# Altium project RWSv3.PrjPcb
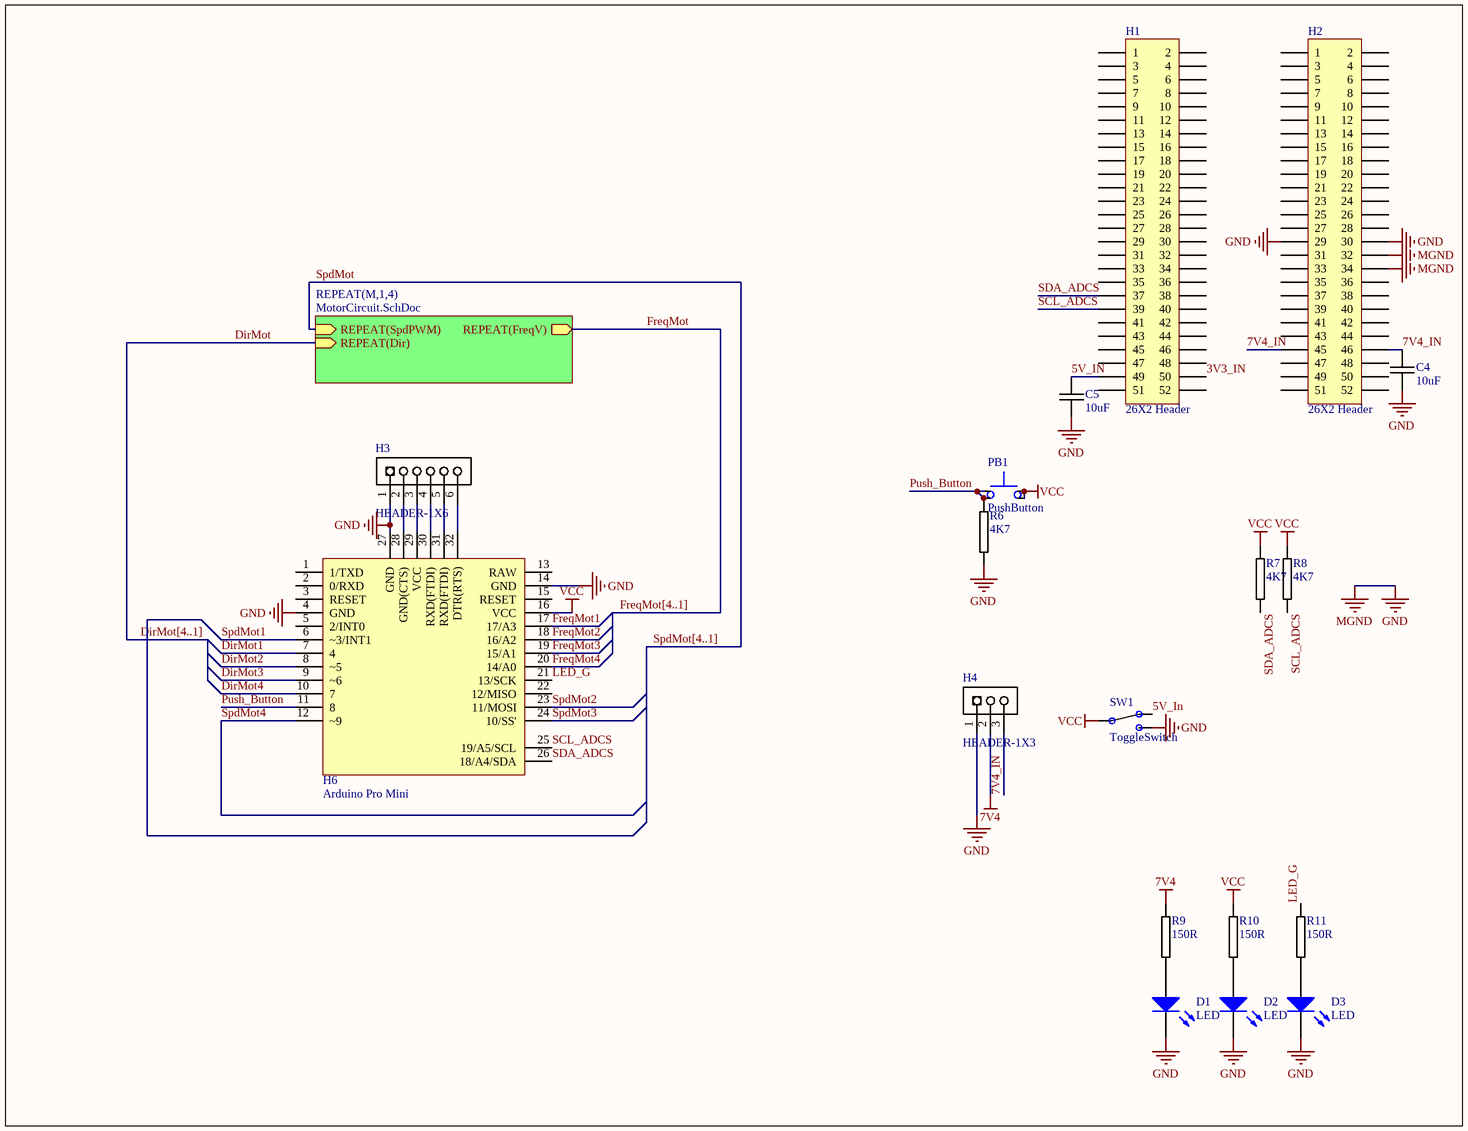
[diagram p0: RWSv3.SchDoc]
2 sheets, 70 parts. Net scope: hierarchical (ports join the sheet entries above them; power ports are global).
Board file: RWSv3.PcbDoc
Sheets:
  RWSv3.SchDoc
    M1 = MotorCircuit.SchDoc
    M2 = MotorCircuit.SchDoc
    M3 = MotorCircuit.SchDoc
    M4 = MotorCircuit.SchDoc

## Sheet RWSv3.SchDoc
size 274 x 210 mm

### Parts
C4  10uF  [0805C-TBD]
C5  10uF  [0805C-TBD]
D1  LED  [LED]
D2  LED  [LED]
D3  LED  [LED]
H1  26X2 Header  [26X2 Header]
H2  26X2 Header  [26X2 Header]
H3  HEADER-1X6  [HEADER-1X6]
H4  HEADER-1X3  [HEADER-1X3]
H6  Arduino Pro Mini  [Arduino Pro Mini]
PB1  PushButton  [PushButton]
R6  4K7  [0805R-4K7]
R7  4K7  [0805R-4K7]
R8  4K7  [0805R-4K7]
R9  150R  [0805R-150]
R10  150R  [0805R-150]
R11  150R  [0805R-150]
SW1  ToggleSwitch  [SWITCHFOOTPRINT]

### Sub-sheets
REPEAT(M,1,4) = MotorCircuit.SchDoc: REPEAT(SpdPWM) (in), REPEAT(Dir) (in), REPEAT(FreqV) (out)

### Nets
7V4: H4.2 R9.1
GND: C4.2 C5.2 D1.2(K) D2.2(K) D3.2(K) H2.29 H2.30 H2.32 H2.34 H3.1 H4.1 H6.4(GND) H6.14(GND) H6.27(GND) R6.2 SW1.25  [also labelled MGND]
VCC: H6.16(VCC) PB1.27 PB1.29 R7.1 R8.1 R10.1 SW1.23
3V3_IN: H1.50
5V_IN: C5.1 H1.49 SW1.24
7V4_IN: C4.1 H2.45 H2.46 H4.3
DirMot: sheet REPEAT(M,1,4)/REPEAT(Dir)
DirMot1: H6.7(4)
DirMot2: H6.8(~5)
DirMot3: H6.9(~6)
DirMot4: H6.10(7)
FreqMot: sheet REPEAT(M,1,4)/REPEAT(FreqV)
FreqMot1: H6.17(17/A3)
FreqMot2: H6.18(16/A2)
FreqMot3: H6.19(15/A1)
FreqMot4: H6.20(14/A0)
LED_G: H6.21(13/SCK) R11.1
Push_Button: H6.11(8) PB1.26 PB1.28 R6.1
SCL_ADCS: H1.39 H6.25(19/A5/SCL) R8.2
SDA_ADCS: H1.37 H6.26(18/A4/SDA) R7.2
SpdMot: sheet REPEAT(M,1,4)/REPEAT(SpdPWM)
SpdMot1: H6.6(~3/INT1)
SpdMot2: H6.23(11/MOSI)
SpdMot3: H6.24(10/SS')
SpdMot4: H6.12(~9)
NetD1_1: D1.1(A) R9.2
NetD2_1: D2.1(A) R10.2
NetD3_1: D3.1(A) R11.2
NetH3_2: H3.2 H6.28(GND(CTS))
NetH3_3: H3.3 H6.29(VCC)
NetH3_4: H3.4 H6.30(RXD(FTDI))
NetH3_5: H3.5 H6.31(RXD(FTDI))
NetH3_6: H3.6 H6.32(DTR(RTS))

Not connected (* = marked no-connect by the designer): H1 1 2 3 4 5 6 7 8 9 10 11 12 13 14 15 16 17 18 19 20 21 22 23 24 25 26 27 28 29 30 31 32 33 34 35 36 38 40 41 42 43 44 45 46 47 48 51 52; H2 1 2 3 4 5 6 7 8 9 10 11 12 13 14 15 16 17 18 19 20 21 22 23 24 25 26 27 28 31 33 35 36 37 38 39 40 41 42 43 44 47 48 49 50 51 52; H6 1(1/TXD) 2(0/RXD) 3(RESET) 5(2/INT0) 13(RAW) 15(RESET) 22(12/MISO)

### Buses and harness runs
bus DirMot[4..1]
bus FreqMot[4..1]
bus SpdMot[4..1]

### Library data of the parts
C4 C5 = 0805C-100nF-25V-X7R-MUR: CAPACITOR 0805 CERAMIC; Supplier 1: Digi-Key; Supplier Part Number 1: 490-1673-1-ND
D1-D3 = LED: Small LED
PB1 = PushButton: pin to pad: 26>5 27>7 28>6 29>8
R6-R8 = 0805R-4K7: RESISTOR 0805 1/4 WATT THIN FILM; Reel: *
R9-R11 = 0805R-150: RESISTOR 0805 1/4 WATT THIN FILM; Reel: *
SW1 = ToggleSwitch: pin to pad: 23>3 24>2 25>4
H3 = HEADER-1X6: Supplier 1: Digi-Key; Supplier Part Number 1: S1011E-36-ND
H4 = HEADER-1X3: Supplier 1: Digi-Key; Supplier Part Number 1: S1011E-36-ND

## Sheet MotorCircuit.SchDoc
size A4
Used 4 times, as channels M1, M2, M3, M4. Parts and nets are listed once, with the designators drawn on the sheet.
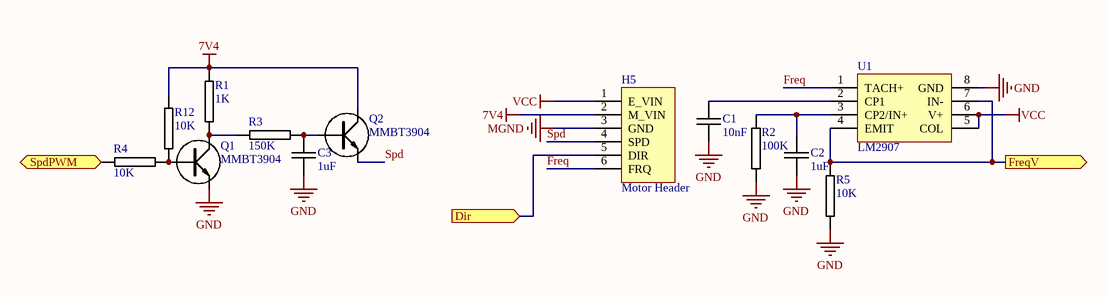
[diagram p1: MotorCircuit.SchDoc]

### Parts
C1  10nF  [0805C-TBD]
C2  1uF  [0805C-GENERIC]
C3  1uF  [0805C-GENERIC]
H5  Motor Header  [Motor Header]
Q1  MMBT3904  [SOT23-BCE]
Q2  MMBT3904  [SOT23-BCE]
R1  1K  [0805R-1K]
R2  100K  [0805R-100K]
R3  150K  [0805R-150K]
R4  10K  [0805R-10K]
R5  10K  [0805R-10K]
R12  10K  [0805R-10K]
U1  LM2907  [LM2907]

### Ports
Dir (in), FreqV (out), SpdPWM (in)

### Nets
7V4: H5.2(M_VIN) Q2.C R1.1 R12.2
GND: C1.2 C2.2 C3.2 Q1.E R2.2 R5.2 U1.8(GND)
MGND: H5.3(GND)
VCC: H5.1(E_VIN) U1.5(COL) U1.6(V+)
Dir: H5.5(DIR) ; port Dir
Freq: H5.6(FRQ) U1.1(TACH+)
FreqV: R5.1 U1.4(EMIT) U1.7(IN-) ; port FreqV
Spd: H5.4(SPD) Q2.E
SpdPWM: R4.1 ; port SpdPWM
NetC1_1: C1.1 U1.2(CP1)
NetC2_1: C2.1 R2.1 U1.3(CP2/IN+)
NetC3_1: C3.1 Q2.B R3.2
NetQ1_B: Q1.B R4.2 R12.1
NetQ1_C: Q1.C R1.2 R3.1

### Channels
M1: designators C1=M1C1 C2=M1C2 C3=M1C3 H5=M1H5 Q1=M1Q1 Q2=M1Q2 R1=M1R1 R2=M1R2 R3=M1R3 R4=M1R4 R5=M1R5 R12=M1R12 U1=M1U1; ports Dir=DirMot1 FreqV=FreqMot1 SpdPWM=SpdMot1
M2: designators C1=M2C1 C2=M2C2 C3=M2C3 H5=M2H5 Q1=M2Q1 Q2=M2Q2 R1=M2R1 R2=M2R2 R3=M2R3 R4=M2R4 R5=M2R5 R12=M2R12 U1=M2U1; ports Dir=DirMot2 FreqV=FreqMot2 SpdPWM=SpdMot2
M3: designators C1=M3C1 C2=M3C2 C3=M3C3 H5=M3H5 Q1=M3Q1 Q2=M3Q2 R1=M3R1 R2=M3R2 R3=M3R3 R4=M3R4 R5=M3R5 R12=M3R12 U1=M3U1; ports Dir=DirMot3 FreqV=FreqMot3 SpdPWM=SpdMot3
M4: designators C1=M4C1 C2=M4C2 C3=M4C3 H5=M4H5 Q1=M4Q1 Q2=M4Q2 R1=M4R1 R2=M4R2 R3=M4R3 R4=M4R4 R5=M4R5 R12=M4R12 U1=M4U1; ports Dir=DirMot4 FreqV=FreqMot4 SpdPWM=SpdMot4

### Library data of the parts
C1 = 0805C-100nF-25V-X7R-MUR: CAPACITOR 0805 CERAMIC; Supplier 1: Digi-Key; Supplier Part Number 1: 490-1673-1-ND
C2 = 0805C-10UF-6V3-X5R-PAN: CAPACITOR 0805 CERAMIC; Manufacturer: Panasonic - ECG; Manufacturer Part Number: ECJ-2FB0J106M; Reel: C1; Capacitance: 10µF; Voltage - Rated: 6.3V; Temperature Coefficient: X5R; Tolerance: ±20%; Supplier 1: Digi-Key; Supplier Part Number 1: PCC2225TR-ND; Supplier: Digi-Key; Operating Temperature: -55°C ~ 85°C; Mounting Type: Surface Mount, MLCC; Lead Spacing: -; RoHS: RoHS Compliant; Packaging: Tape & Reel (TR); Thickness: 1.25mm; Package / Case: 0805 (2012 metric); Features: General Purpose; Category: Capacitors; Supplier Part Number: PCC2225TR-ND
C3 = 0805C-2U2-6V3-X5R-PAN: CAPACITOR 0805 CERAMIC; Manufacturer Part Number: ECJ-1VB0J225K; Manufacturer: Panasonic - ECG; Reel: C7; Supplier 1: Digi-Key; Supplier Part Number 1: PCC2273TR-ND
Q1 Q2 = MMBT2222: BC847 SMALL SIGNAL NPN TRANSISTOR; Supplier 1: Digi-Key; Supplier Part Number 1: MMBT2222A-FDICT-ND
R1 = 0805R-1K: RESISTOR 0805 1/4 WATT THIN FILM; Reel: *
R2 = 0805R-100K: RESISTOR 0805 1/4 WATT THIN FILM; Reel: *; Supplier 1: Digi-Key; Supplier Part Number 1: RMCF0805FT100KTR-ND
R3 = 0805R-150K: RESISTOR 0805 1/4 WATT THIN FILM; Reel: *
R4 R5 R12 = 0805R-10K: RESISTOR 0805 1/4 WATT THIN FILM; Reel: *
U1 = LM2907: Freq to Voltage Converter

## Nets that join several sheets
7V4: RWSv3 (H4.2 R9.1), M1 (M1H5.2 M1Q2.C M1R1.1 M1R12.2), M2 (M2H5.2 M2Q2.C M2R1.1 M2R12.2), M3 (M3H5.2 M3Q2.C M3R1.1 M3R12.2), M4 (M4H5.2 M4Q2.C M4R1.1 M4R12.2)
GND: RWSv3 (16 pins), M1 (8 pins), M2 (8 pins), M3 (8 pins), M4 (8 pins)
VCC: RWSv3 (7 pins), M1 (M1H5.1 M1U1.5 M1U1.6), M2 (M2H5.1 M2U1.5 M2U1.6), M3 (M3H5.1 M3U1.5 M3U1.6), M4 (M4H5.1 M4U1.5 M4U1.6)
DirMot1: RWSv3 (H6.7), M1 (M1H5.5)
DirMot2: RWSv3 (H6.8), M2 (M2H5.5)
DirMot3: RWSv3 (H6.9), M3 (M3H5.5)
DirMot4: RWSv3 (H6.10), M4 (M4H5.5)
FreqMot1: RWSv3 (H6.17), M1 (M1R5.1 M1U1.4 M1U1.7)
FreqMot2: RWSv3 (H6.18), M2 (M2R5.1 M2U1.4 M2U1.7)
FreqMot3: RWSv3 (H6.19), M3 (M3R5.1 M3U1.4 M3U1.7)
FreqMot4: RWSv3 (H6.20), M4 (M4R5.1 M4U1.4 M4U1.7)
SpdMot1: RWSv3 (H6.6), M1 (M1R4.1)
SpdMot2: RWSv3 (H6.23), M2 (M2R4.1)
SpdMot3: RWSv3 (H6.24), M3 (M3R4.1)
SpdMot4: RWSv3 (H6.12), M4 (M4R4.1)